# Altium schematic sheet 01_TOP_LEVEL.SchDoc
size A4; SheetNumber: 1; SheetTotal: 3
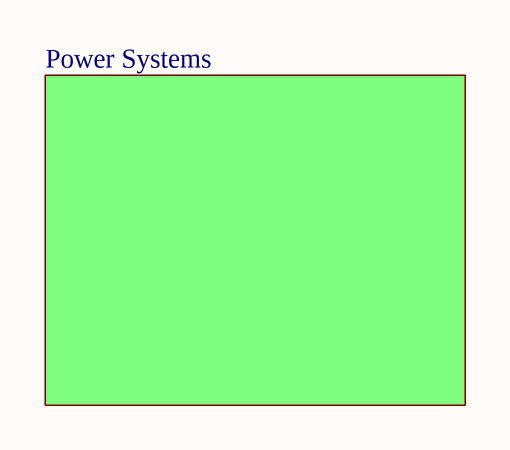
[diagram p0: 01_TOP_LEVEL.SchDoc]

## Sub-sheets
Power Systems = 02_POWER_SYSTEMS: no entries